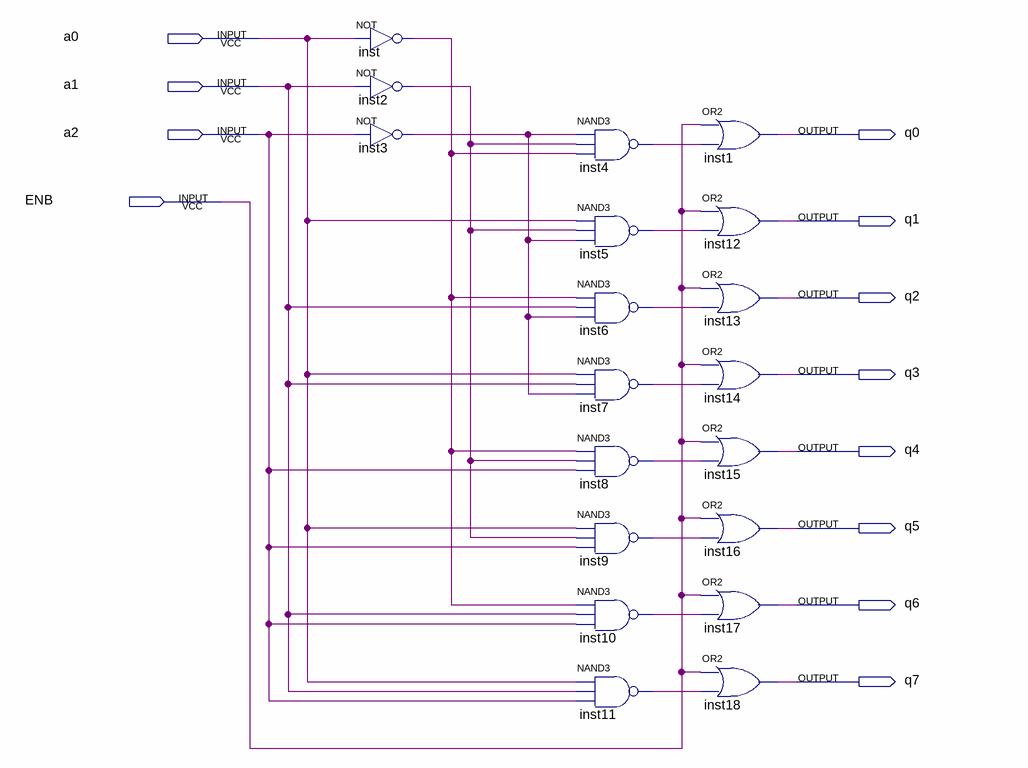
[diagram p0: schematic sheet]
// Quartus schematic DC_graph.bdf as structural Verilog: 19 symbols, 12 pins
module DC_graph (
  input  a0,
  input  a1,
  input  a2,
  input  ENB,
  output q0,
  output q1,
  output q2,
  output q3,
  output q4,
  output q5,
  output q6,
  output q7
);

  wire inst2_out, inst3_out, inst4_out, inst5_out, inst6_out, inst7_out, inst8_out, inst9_out, inst10_out,
       inst11_out, inst_out;

  not inst (inst_out, a0);
  not inst2 (inst2_out, a1);
  not inst3 (inst3_out, a2);
  nand inst4 (inst4_out, inst3_out, inst2_out, inst_out);
  nand inst5 (inst5_out, a0, inst2_out, inst3_out);
  nand inst6 (inst6_out, inst_out, a1, inst3_out);
  nand inst7 (inst7_out, a0, a1, inst3_out);
  nand inst8 (inst8_out, inst_out, inst2_out, a2);
  nand inst9 (inst9_out, a0, inst2_out, a2);
  nand inst10 (inst10_out, inst_out, a1, a2);
  nand inst11 (inst11_out, a0, a1, a2);
  or inst1 (q0, ENB, inst4_out);
  or inst12 (q1, ENB, inst5_out);
  or inst13 (q2, ENB, inst6_out);
  or inst14 (q3, ENB, inst7_out);
  or inst15 (q4, ENB, inst8_out);
  or inst16 (q5, ENB, inst9_out);
  or inst17 (q6, ENB, inst10_out);
  or inst18 (q7, ENB, inst11_out);
endmodule
